# EAGLE design data_proV2.0 - B (EAGLE 8.0.1)
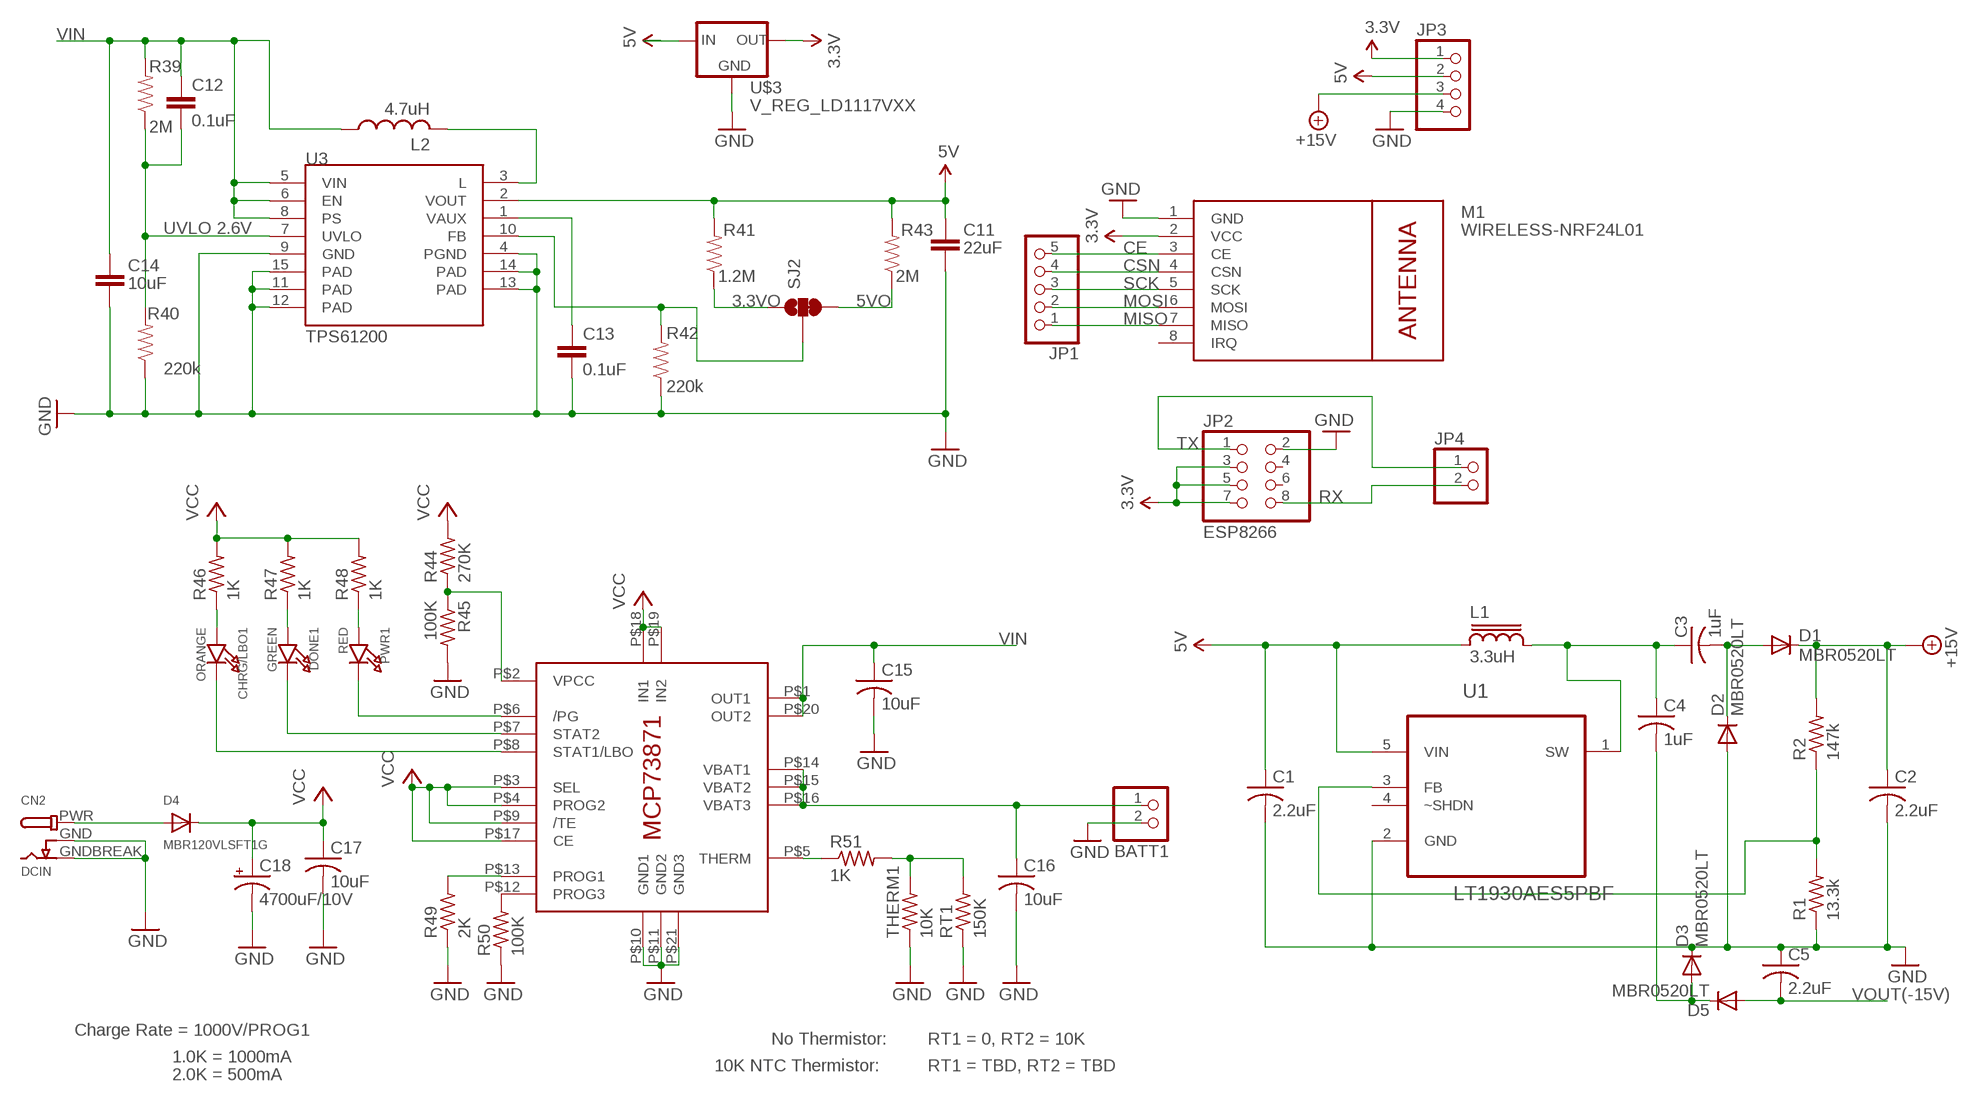
[diagram p0: schematic, sheet 1]

## Parts
BATT1  JST_2PIN-SMT-RA  [JST-PH-2-SMT-RA]
C1  2.2uF  C-USC0805  [C0805]
C2  2.2uF  C-USC1206  [C1206]
C3  1uF  C-USC1206  [C1206]
C4  1uF  C-USC1206  [C1206]
C5  2.2uF  C-USC1206  [C1206]
C11  22uF  CAP0805  [0805]
C12  0.1uF  CAP0603-CAP  [0603-CAP]
C13  0.1uF  CAP0603-CAP  [0603-CAP]
C14  10uF  CAP1206  [1206]
C15  10uF  C-USC0805K  [C0805K]
C16  10uF  C-USC0805K  [C0805K]
C17  10uF  C-USC0805K  [C0805K]
C18  4700uF/10V  CPOL-USE5-13  [E5-13]
CHRG/LBO1  ORANGE  LED0805_NOOUTLINE  [CHIPLED_0805_NOOUTLINE]
CN2  DCIN  DCBARRELSMT  [DCJACK_2MM_SMT]
D1  MBR0520LT  [SOD123]
D2  MBR0520LT  [SOD123]
D3  MBR0520LT  [SOD123]
D4  MBR120VLSFT1G  DIODESOD-123  [SOD-123]
D5  MBR0520LT  [SOD123]
DONE1  GREEN  LED0805_NOOUTLINE  [CHIPLED_0805_NOOUTLINE]
IC8  MCP73871  [QFN20_4MM]
JP1  PINHD-1X5  [1X05]
JP2  ESP8266  PINHD-2X4  [2X04]
JP3  PINHD-1X4  [1X04]
JP4  PINHD-1X2  [1X02]
L1  3.3uH  CR43  [CR43]
L2  4.7uH  L-USL3225M  [L3225M]
M1  WIRELESS-NRF24L01  [WIRELESS-NRF24L01]
PWR1  RED  LED0805_NOOUTLINE  [CHIPLED_0805_NOOUTLINE]
R1  13.3k  R-US_R0805  [R0805]
R2  147k  R-US_R0805  [R0805]
R39  2M  RESISTOR0603-RES  [0603-RES]
R40  220k  RESISTOR0603-RES  [0603-RES]
R41  1.2M  RESISTOR0603-RES  [0603-RES]
R42  220k  RESISTOR0603-RES  [0603-RES]
R43  2M  RESISTOR0603-RES  [0603-RES]
R44  270K  R-US_R0805  [R0805]
R45  100K  R-US_R0805  [R0805]
R46  1K  R-US_R0805  [R0805]
R47  1K  R-US_R0805  [R0805]
R48  1K  R-US_R0805  [R0805]
R49  2K  R-US_FLIPFLOP  [0805-THM]
R50  100K  R-US_R0805  [R0805]
R51  1K  R-US_M0805  [M0805]
RT1  150K  R-US_M0805  [M0805]
SJ2  SOLDERJUMPER_2WAYPASTE2&3  [SJ_3_PASTE2&3]
THERM1  10K  R-US_FLIPFLOP  [0805-THM]
U1  LT1930AES5PBF  [SOT95P280X145-5N]
U3  TPS61200  [QFN-10_PAD]
U$3  V_REG_LD1117VXX  [78XXL]

## Nets
3.3V: JP2.3 JP2.5 JP2.7 JP3.1 M1.2(VCC) U$3.GND(OUT)
3.3VO: R41.1 SJ2.1
5V: C1.1 C11.1 JP3.2 L1.1 R41.2 R43.2 U1.5(VIN) U3.2(VOUT) U$3.OUT(IN)
5VO: R43.1 SJ2.3
+15V: C2.1 D1.C JP3.3 R2.2
BATT2: BATT1.1 C16.1 IC8.P$14(VBAT1) IC8.P$15(VBAT2) IC8.P$16(VBAT3)
CE: JP1.5 M1.3(CE)
CSN: JP1.4 M1.4(CSN)
FB1: R42.2 SJ2.2 U3.10(FB)
GND: BATT1.2 C1.2 C2.2 C5.1 C11.2 C13.2 C14.2 C15.2 C16.2 C17.2 C18.- CN2.GND(GNDBREAK) CN2.GNDBREAK(GND) D2.A D3.C IC8.P$10(GND1) IC8.P$11(GND2) IC8.P$21(GND3) JP2.2 JP3.4 M1.1(GND) R1.1 R40.1 R42.1 R45.2 R49.1 R50.1 RT1.1 THERM1.1 U1.2(GND) U3.4(PGND) U3.9(GND) U3.11(PAD) U3.12(PAD) U3.13(PAD) U3.14(PAD) U3.15(PAD) U$3.IN(GND)
MISO: JP1.1 M1.7(MISO)
MOSI: JP1.2 M1.6(MOSI)
N$1: C4.2 D3.A D5.C
N$2: C3.1 C4.1 L1.2 U1.1(SW)
N$3: R1.2 R2.1 U1.3(FB)
N$4: C3.2 D1.A D2.C
N$37: L2.2 U3.3(L)
N$38: C13.1 U3.1(VAUX)
N$39: IC8.P$2(VPCC) R44.1 R45.1
N$40: IC8.P$6(/PG) PWR1.C
N$41: DONE1.C IC8.P$7(STAT2)
N$42: CHRG/LBO1.C IC8.P$8(STAT1/LBO)
N$43: CHRG/LBO1.A R46.1
N$44: DONE1.A R47.1
N$45: PWR1.A R48.1
N$46: IC8.P$12(PROG3) R50.2
N$47: IC8.P$13(PROG1) R49.2
N$48: IC8.P$5(THERM) R51.1
N$49: R51.2 RT1.2 THERM1.2
N$50: CN2.PWR D4.A
RX: JP2.8 JP4.2
SCK: JP1.3 M1.5(SCK)
TX: JP2.1 JP4.1
UVLO1: C12.2 R39.1 R40.2 U3.7(UVLO)
VCC: C17.1 C18.+ D4.C IC8.P$3(SEL) IC8.P$4(PROG2) IC8.P$9(/TE) IC8.P$17(CE) IC8.P$18(IN1) IC8.P$19(IN2) R44.2 R46.2 R47.2 R48.2
VIN: C12.1 C14.1 C15.1 IC8.P$1(OUT1) IC8.P$20(OUT2) L2.1 R39.2 U3.5(VIN) U3.6(EN) U3.8(PS)
VOUT(-15V): C5.2 D5.A
Unconnected: JP2.4 JP2.6 M1.8(IRQ) U1.4(~SHDN)

## Notes on the sheet
- UVLO 2.6V
- Charge Rate = 1000V/PROG1
- No Thermistor: | RT1 = 0, RT2 = 10K
- 1.0K = 1000mA
- 10K NTC Thermistor: | RT1 = TBD, RT2 = TBD
- 2.0K = 500mA

## Library data of the parts
BATT1 = adafruit:JST_2PIN: JST 2-Pin Connectors of various flavors SMT-RA (S2B-PH-SM4) 4UConnector #17311 SMT (B2B-PH-SM4) THM-RA (S2B-PH) THM (B2B-PH)
C1 C15-C17 = adafruit:C-US: CAPACITOR, American symbol
C2-C5 = rcl:C-US: CAPACITOR, American symbol
C11 C14 = CH_passive:CAP: Capacitor Standard 0603 ceramic capacitor, and 0.1" leaded capacitor.
C12 C13 = SparkFun:CAP: Capacitor Standard 0603 ceramic capacitor, and 0.1" leaded capacitor.
C18 = adafruit:CPOL-US: POLARIZED CAPACITOR, American symbol
CHRG/LBO1 DONE1 PWR1 = microbuilder:LED: LED 0603 - 0603 Surface Mount Package 2mA: Green LED - Low Power (3.9mcd, 2ma, 1.7Vf) - Digikey: 475-2709-2-ND Orange LED - Low Power (9.8mcd, 2ma, 1.8Vf) - Digikey: 475-1194-2-ND Red LED - Low Power (5mcd, 2ma, 1.8Vf) - Digikey: 475-1195-2-ND Yellow LED - Low Power (7mcd, 2ma, 1.8Vf) - Digikey: 475-1196-2-ND 5mA: Blue LED - Low Power (17mcd, 5ma, 2.9Vf) - Digikey: LNJ937W8CRACT-ND 0805 - 0805 Surface Mount Package 2mA: Red LED (8.8mcd, 2mA, 1.8Vf, Clear) - Low Power [Digikey: 475-2510-1-ND] Green LED (5mcd, 2mA, 1.8Vf, Clear) - Low Power [Digikey: 475-2730-1-ND] Yellow LED (11.3mcd, 2mA, 1.8Vf, Clear) - Low Power [Digikey: 475-2555-1-ND] 20mA: Red LED (104mcd, 20mA, Diffused) - LS R976 [Digikey: 475-1278-6-ND] Red LED (12mcd, 20mA, 2.0Vf, Clear) - APT2012EC [Digikey: 754-1128-1-ND] Green LED (15mcd, 20mA, 2.2Vf, Clear) - APT2012GC [Digikey: 754-1131-1-ND] Orange LED (160mcd, 20mA, 2.1Vf, Clear) - APT2012SECK [Digikey: 754-1130-1-ND] 1206 - 1206 Surface Mount Package Green LED (26mcd, 20mA, Diffused) - LG N971 [Digikey: 475-1407-6-ND] Red LED (15mcd, 20mA, Diffused) - LH N974 [Digikey: 475-1416-6-ND] Cree - Cree High-Power Surface Mount LEDs XPEBWT-L1-0000-00D50 - White 111lm 350mA 2.9Vf 6200K 110° XTEAWT-00-0000-00000LEE3 - White 114lm 350mA 2.85Vf 5000K 115° Everlight - Everlight 45-21 Series Surface Mount LEDs 45-21/QK2C-B2832AC2CB2/2T - Warm White 2000mcd 20mA 3.25Vf 3050K 120° 45-21/LK2C-B38452C4CB2/2T - Nuetral White 2000mcd 20mA 3.25Vf 4150K 120° 45-21/LK2C-B50634C6CB2/2T - Cold White 2200mcd 20mA 3.25Vf 5650K 120° PLCC2 Reverse Mount LS T77K-J1L2-1-0-2-R18-Z - Red 11.25mcd 2mA 1.8Vf 630nm 120° LO T77K-L1M2-24-Z - Orange 19.6mcd 2mA 1.8Vf 606nm 120° LY T77K-K2M1-26-Z - Yellow 15.7mcd 2mA 1.8Vf 587nm 120°
CN2 = microbuilder:DCBARREL: DC Barrel Jack DCJACK_1.3MM_PTH - Through Hole 1.3mm Jack (4UConnector: 05536) DCJACK_2MM_PTH - Through Hole 2.0/2.1 Jack (4UConnector: 05537) DCJACK_2MM_SMT - SMT 2.0/2.1mm Jack(4UConnector: 03267)
D1-D3 D5 = diode:MBR0520LT: SCHOTTKY BARRIER RECTIFIER Source: http://onsemi.com .. MBR0520LT1-D.pdf
D4 = microbuilder:DIODE: Diode SMA Model Volts Amps Type Vf Vr Digikey # Notes SSA34-E3 40V 3A Schottky 480mV @ 3A 200uA @ 40V SSA34-E3/61TGITR-ND CDBA120-G 20V 1A Schottky 500mV @ 1A 500uA @ 20V 641-1014-6-ND REEL MBRA210 10V 2A Schottky 350mV @ 2A 700uA @ 10V MBRA210LT3 SOD-123 Model Volts Amps Type Vf Vr Order # Notes BAT54T1G 30V 200mA Schottky 800mV @ 200mA 2uA @ 25V BAT54T1GOSTR-ND B0530W 30V 500mA Schottky 430mV @ 500mA 130uA @ 30V B0530W-FDICT-ND REEL MBR120 20V 1A Schottky 340mV @ 1A MBR120VLSFT1GOSCT-ND SOD-323 Model Volts Amps Type Vf Vr Order # Notes PMEG2005EJ 20V 500mA Schottky 355mV @ 500mA 568-4110-1-ND ZLLS410 10V 570mA Schottky 380mV @ 570mA ZLLS410CT-ND 1N4148WS 75V 150mA Silicon/Simple 1V 1N4148WSFSCT-ND REEL SOD-523 Model Volts Amps Type Vf Vr Order # Notes BAT54XV2 30V 200mA Schottky 0.8V @ 100mA BAT54XV2CT-ND TB751S 30V 30mA Schottky RB751S-40TE61CT-ND SOT23-R/W (R = Solder Paste/Reflow Ovens, W = Hand-Soldering) Model Volts Amps Type Vf Vr Order # Notes BAT54FILM 40V 300mA Schottky 497-7162-1-ND
IC8 = adafruit:MCP73871
JP1 = pinhead:PINHD-1X5: PIN HEADER
JP2 = adafruit:PINHD-2X4: PIN HEADER
JP3 = pinhead:PINHD-1X4: PIN HEADER
JP4 = pinhead:PINHD-1X2: PIN HEADER
L1 = inductor-sumida:CR43: Power Inductor
L2 = resistor:L-US: INDUCTOR, American symbol
M1 = diy-modules:WIRELESS-NRF24L01: 2.4 GHz Wireless Module based on NRF24L01 chip More details available here: http://www.electrodragon.com/w/NRF24L01 Click here to find device on ebay.com <http://www.ebay.com/sch/nrf24l01+arduino>
R1 R2 = rcl:R-US_: RESISTOR, American symbol
R39-R43 = SparkFun:RESISTOR: Resistor Basic schematic elements and footprints for 0603, 1206, and PTH resistors.
R44-R51 RT1 THERM1 = adafruit:R-US_: RESISTOR, American symbol
SJ2 = SparkFun:SOLDERJUMPER_2WAY: Solder Jumper 2 way solder jumper
U1 = LTC_By_element14_Batch_1:LT1930AES5PBF: DC/DC Converter; MPN: LT1930AES5#PBF; OC_FARNELL: 1531503; OC_NEWARK: 61M3368; PACKAGE: SOT-23-5; SUPPLIER: Linear Technology
U3 = SparkFun:TPS61200: DC to DC Booster
U$3 = SparkFun-PowerIC:V_REG_LD1117VXX: LD1117VXX voltage regulator. We carry the 3.3V version (COM-00526) in TO-220 package.

## Board
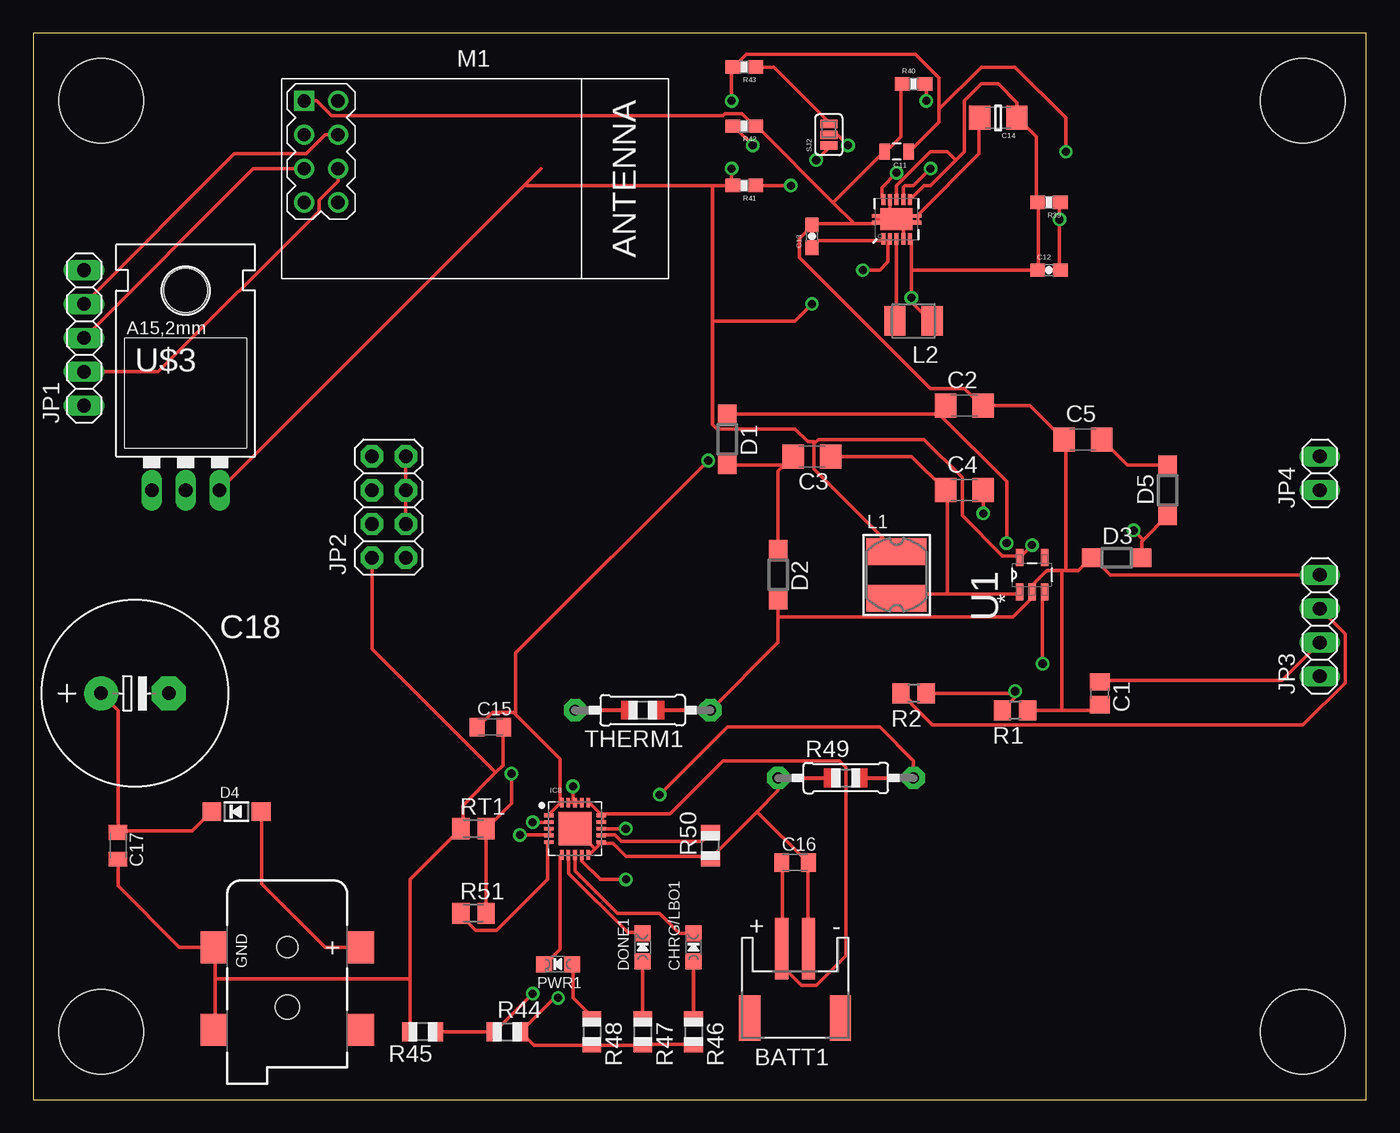
[diagram p1: board, top side]
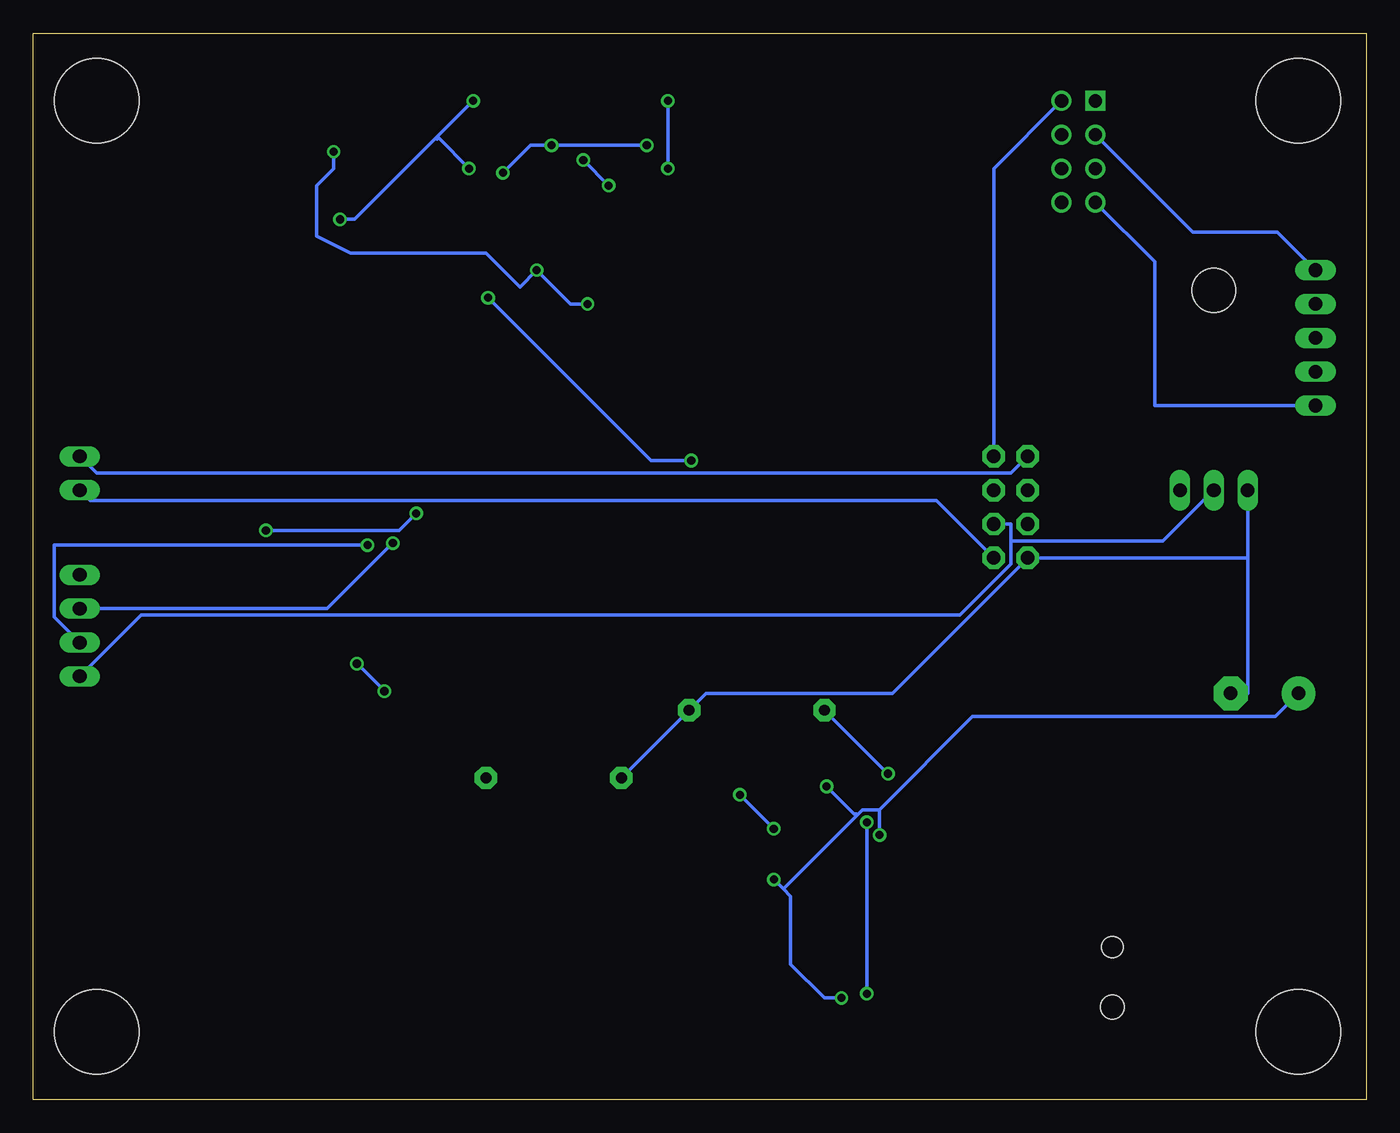
[diagram p2: board, bottom side, seen from below]

Size 100 x 80 mm. Coordinates in mm from the lower left corner, seen from the top.
Outline: 0,0 100,0 100,80 0,80 0,0
Copper layers (1*16): Top 0.035mm / dielectric 1.5mm / Bottom 0.035mm
Design rules "data_proV2.0 - B": minimum track width 10mil, minimum drill 24mil, track to track 8mil, track to pad 8mil, pad to pad 8mil, via to via 8mil, smd to smd 8mil, copper to edge 40mil, drill to drill 8mil, minimum pad ring 10mil, minimum via ring 8mil, stop-mask expansion 4mil, vias tented up to drill 0mil, thermal gap 10mil
Holes 6.35 mm at 5.08,5.08 95.25,5.08 95.25,74.93 5.08,74.93

### Footprints (pad centres in the part's own frame; a part is rotated, then mirrored left to right if it is on the bottom)
JST-PH-2-SMT-RA = smd 1 x 4.6: 1 1,-3.7; 2 -1,-3.7 | smd 1.6 x 3.4: NC1 -3.4,1.5; NC2 3.4,1.5
C0805 = smd 1.3 x 1.5: 1 -0.85,0; 2 0.85,0
C1206 = smd 1.6 x 1.8: 1 -1.4,0; 2 1.4,0
0805 = smd 0.8 x 1.2: 1 -0.9,0; 2 0.9,0
0603-CAP = smd 1.1 x 1: 1 -0.85,0; 2 0.85,0
1206 = smd 1.6 x 1.8: 1 -1.4,0; 2 1.4,0
C0805K = smd 1.1 x 1.4: 1 -1,0; 2 1,0
E5-13 = drill 1.016 pad 2.54: + -2.54,0 | drill 1.016 pad 2.54 octagon: - 2.54,0
CHIPLED_0805_NOOUTLINE = smd 1.2 x 1.2: A 0,-1.05; C 0,1.05
DCJACK_2MM_SMT = smd 2.4 x 2: GND 0,-5.5; GNDBREAK 6.2,-5.5; PWR 0,5.5; PWR2 6.2,5.5 | hole 1.6: 0,0 | hole 1.8: 4.5,0
SOD123 = smd 1.4 x 1.4: A 1.9,0; C -1.9,0
SOD-123 = smd 1.4 x 1.4: A 1.85,0; C -1.85,0
QFN20_4MM = smd 0.73 x 0.28: P$1 -1.965,1; P$2 -1.965,0.5; P$3 -1.965,0; P$4 -1.965,-0.5; P$5 -1.965,-1; P$11 1.965,-1; P$12 1.965,-0.5; P$13 1.965,0; P$14 1.965,0.5; P$15 1.965,1 | smd 0.28 x 0.73: P$6 -1,-1.965; P$7 -0.5,-1.965; P$8 0,-1.965; P$9 0.5,-1.965; P$10 1,-1.965; P$16 1,1.965; P$17 0.5,1.965; P$18 0,1.965; P$19 -0.5,1.965; P$20 -1,1.965 | smd 2.5 x 2.5: P$21 0,0
1X05 = drill 1.016 long: 1 -5.08,0; 2 -2.54,0; 3 0,0; 4 2.54,0; 5 5.08,0
2X04 = drill 1.016 pad 1.676 octagon: 1 -3.81,-1.27; 2 -3.81,1.27; 3 -1.27,-1.27; 4 -1.27,1.27; 5 1.27,-1.27; 6 1.27,1.27; 7 3.81,-1.27; 8 3.81,1.27
1X04 = drill 1.016 long: 1 -3.81,0; 2 -1.27,0; 3 1.27,0; 4 3.81,0
1X02 = drill 1.016 long: 1 -1.27,0; 2 1.27,0
CR43 = smd 4.5 x 2: 1 0,1.75; 2 0,-1.75
L3225M = smd 1.6 x 2.2: 1 -1.4,0; 2 1.4,0
WIRELESS-NRF24L01 = drill 1 square: 1 -12.7,6.35 | drill 1: 2 -10.16,6.35; 3 -12.7,3.81; 4 -10.16,3.81; 5 -12.7,1.27; 6 -10.16,1.27; 7 -12.7,-1.27; 8 -10.16,-1.27
R0805 = smd 1.3 x 1.5: 1 -0.95,0; 2 0.95,0
0603-RES = smd 1.1 x 1: 1 -0.85,0; 2 0.85,0
R0805' = smd 1.1 x 1.4: 1 -1,0; 2 1,0
0805-THM = drill 0.813 pad 1.676 octagon: 1 -5.08,0; 2 5.08,0
M0805 = smd 1.3 x 1.6: 1 -0.95,0; 2 0.95,0
SJ_3_PASTE2&3 = smd 0.635 x 1.27: 1 -0.813,0; 2 0,0; 3 0.813,0
SOT95P280X145-5N = smd 1.27 x 0.559: 1 -1.295,0.94; 2 -1.295,0; 3 -1.295,-0.94; 4 1.295,-0.94; 5 1.295,0.94
QFN-10_PAD = smd 0.297 x 0.85: 1 -1,-1.475; 2 -0.5,-1.475; 3 0,-1.475; 4 0.5,-1.475; 5 1,-1.475; 6 1,1.475; 7 0.5,1.475; 8 0,1.475; 9 -0.5,1.475; 10 -1,1.475 | smd 0.7 x 0.28: 11 -1.5,0.25; 12 -1.5,-0.25; 13 1.5,0.25; 14 1.5,-0.25 | smd 2.4 x 1.65: 15 0,0
78XXL = drill 1.016 long: GND 0,-3.81; IN -2.54,-3.81; OUT 2.54,-3.81 | hole 3.302: 0,11.176

### Placement (x,y rotation side)
BATT1  57.15,7.62 180 top
C1  80.01,30.48 270 top
C2  69.85,52.07 0 top
C3  58.42,48.26 180 top
C4  69.85,45.72 0 top
C5  78.74,49.53 0 top
C11  64.77,71.12 180 top
C12  76.2,62.23 0 top
C13  58.42,64.77 90 top
C14  72.39,73.66 180 top
C15  34.29,27.94 0 top
C16  57.15,17.78 0 top
C17  6.35,19.05 270 top
C18  7.62,30.48 0 top
CHRG/LBO1  49.53,11.43 0 top
CN2  19.05,11.43 270 top
D1  52.07,49.53 270 top
D2  55.88,39.37 270 top
D3  81.28,40.64 0 top
D4  15.24,21.59 0 top
D5  85.09,45.72 90 top
DONE1  45.72,11.43 0 top
IC8  40.64,20.32 0 top
JP1  3.81,57.15 90 top
JP2  26.67,44.45 90 top
JP3  96.52,35.56 90 top
JP4  96.52,46.99 90 top
L1  64.77,39.37 0 top
L2  66.04,58.42 180 top
M1  33.02,68.58 0 top
PWR1  39.37,10.16 90 top
R1  73.66,29.21 180 top
R2  66.04,30.48 180 top
R39  76.2,67.31 180 top
R40  66.04,76.2 0 top
R41  53.34,68.58 180 top
R42  53.34,73.03 180 top
R43  53.34,77.47 180 top
R44  270K  [R0805']  35.56,5.08 0 top
R45  100K  [R0805']  29.21,5.08 180 top
R46  1K  [R0805']  49.53,5.08 270 top
R47  1K  [R0805']  45.72,5.08 270 top
R48  1K  [R0805']  41.91,5.08 270 top
R49  60.96,24.13 0 top
R50  100K  [R0805']  50.8,19.05 90 top
R51  33.02,13.97 0 top
RT1  33.02,20.32 0 top
SJ2  59.69,72.39 90 top
THERM1  45.72,29.21 180 top
U1  74.93,39.37 90 top
U3  64.77,66.04 0 top
U$3  11.43,49.53 0 top

### Tracks (layer width: path | path; a pad name or v marks a point on that pad's centre or on a via)
3.3V
  Top 0.254: JP2.7 JP2.5 JP2.3
  Bottom 0.254: M1.2 27.94,69.85 JP2.7 | JP3.1 91.92,36.35 30.48,36.35 26.67,40.16 26.67,41.91 | 26.67,41.91 26.67,43.18 JP2.3 | U$3.GND 15.24,41.91 26.67,41.91
3.3VO  (via drill 0.61)
  Top 0.254: v56.83,68.58 R41.1 | v58.74,70.48 59.69,71.44 SJ2.1
  Bottom 0.254: v58.74,70.48 v56.83,68.58
5V  (via drill 0.6, 0.61)
  Top 0.254: JP3.2 93.66,31.43 80.01,31.43 C1.1 | 58.66,49.29 58.58,49.21 58.58,47.31 L1.1 | 58.66,49.29 58.9,49.53 66.83,49.53 69.69,46.67 69.69,43.81 72.71,40.8 73.98,40.8 U1.5 74.14,40.8 v74.93,41.59 | U$3.OUT 36.91,68.66 | 36.91,68.66 38.1,69.85 | 58.66,49.29 58.58,49.37 58.1,49.37 57.15,50.32 51.28,50.32 50.96,50.64 50.96,58.42 | C11.1 65.72,71.12 67.94,73.34 67.94,76.68 66.2,78.42 53.5,78.42 52.55,77.47 R43.2 52.39,77.47 v52.39,74.93 | 50.96,68.58 36.99,68.58 36.91,68.66 | 50.96,68.58 52.39,68.58 | 50.96,58.42 50.96,68.58 | 52.39,68.58 v52.39,69.85 | 52.39,68.58 R41.2 | 50.96,58.42 57.15,58.42 v58.42,59.69 | v62.23,62.23 63.5,62.23 64.14,62.87 64.14,64.43 U3.2 | 67.94,73.66 67.94,74.3 71.12,77.47 73.66,77.47 77.47,73.66 v77.47,71.12
  Bottom 0.254: JP3.2 98.42,36.2 98.42,41.59 v74.93,41.59 | v52.39,69.85 v52.39,74.93 | v58.42,59.69 59.69,59.69 v62.23,62.23 63.5,60.96 66.04,63.5 76.2,63.5 78.74,64.77 78.74,68.58 77.47,69.85 v77.47,71.12
5VO
  Top 0.254: R43.1 55.56,77.47 59.69,73.34 SJ2.3
+15V  (via drill 0.61)
  Top 0.254: D1.C 67.79,51.44 68.42,52.07 C2.1 67.94,51.44 73.03,46.35 v73.03,41.75 | JP3.3 98.42,34.92 98.42,31.27 95.25,28.1 67.47,28.1 65.88,29.69 65.88,29.84 65.25,30.48 R2.2
  Bottom 0.254: v73.03,41.75 77.95,36.83 JP3.3
BATT2
  Top 0.254: IC8.P$14 42.7,20.95 42.7,21.27 IC8.P$15 | IC8.P$16 41.75,22.23 42.55,21.43 IC8.P$15 | C16.1 56.2,17.78 56.2,11.43 BATT1.1 56.2,11.27 56.2,10 57.63,8.57 58.74,8.57 60.96,10.79 60.96,24.92 60.48,25.4 51.75,25.4 47.78,21.43 42.7,21.43 IC8.P$15
CE
  Bottom 0.254: M1.3 13.02,65.09 6.67,65.09 JP1.5
CSN
  Top 0.254: M1.4 21.91,72.39 20.48,70.96 15.08,70.96 JP1.4
FB1  (via drill 0.61)
  Top 0.254: v64.77,69.53 63.66,68.42 63.66,67.63 U3.10 | v61.12,71.6 60.33,72.39 SJ2.2 | v53.98,71.6 52.55,73.03 R42.2
  Bottom 0.254: v64.77,69.53 62.71,71.6 v61.12,71.6 v53.98,71.6
GND
  Top 0.254: C17.2 6.35,16.03 10.95,11.43 CN2.GND 13.65,11.43 13.65,9.05 | 13.65,9.05 13.65,5.24 CN2.GNDBREAK | 28.26,9.05 28.26,16.51 RT1.1 32.23,20.32 32.23,22.07 34.69,24.53 | 28.26,9.05 28.26,5.08 R45.2 | 34.69,24.53 35.24,25.08 35.24,27.94 C15.2 | 28.26,9.05 13.65,9.05 | JP2.2 25.4,33.81 34.69,24.53 | M1.1 21.27,74.93 22.38,73.82 51.75,73.82 51.91,73.98 53.18,73.98 54.13,73.03 R42.1 54.29,73.03 60.01,67.31 | 42.15,18.81 42.55,19.21 IC8.P$11 42.7,19.21 43.5,19.21 44.45,18.26 50.8,18.26 R50.1 50.8,18.1 54.29,21.59 | 42.15,18.81 41.75,18.41 IC8.P$10 | IC8.P$21 42.15,18.81 | 55.88,36.2 55.88,34.29 THERM1.1 | 55.88,36.2 D2.A | 77.15,29.21 79.69,29.21 80.01,29.53 C1.2 | 77.15,29.21 R1.1 | 77.47,39.69 78.42,39.69 D3.C 79.53,40.64 80.8,39.37 JP3.4 | 77.47,39.69 77.15,39.69 | 77.15,39.69 76.04,39.69 74.93,38.58 U1.2 74.93,37.62 73.5,36.2 55.88,36.2 | 77.15,39.69 77.15,29.21 | 77.47,39.69 77.47,49.53 C5.1 77.31,49.53 74.77,52.07 C2.2 71.12,52.07 69.85,53.34 67.31,53.34 57.47,63.18 57.47,64.61 58.42,65.56 C13.2 58.42,65.72 61.59,65.72 | R40.1 65.09,76.2 65.09,72.23 63.98,71.12 C11.2 63.82,71.12 60.01,67.31 | 63.34,66.04 63.34,66.2 U3.11 | 63.34,66.04 63.34,65.88 | U3.15 63.34,66.04 | 63.34,65.88 66.2,65.88 U3.14 66.36,65.88 66.36,66.2 U3.13 66.36,66.36 70.96,70.96 70.96,73.66 C14.2 | 63.34,65.88 U3.12 63.18,65.72 61.59,65.72 | 61.59,65.72 60.01,67.31 | U3.4 65.27,65.54 U3.15 | U3.9 64.27,66.54 U3.15 | 58.1,17.78 58.1,11.43 BATT1.2 | 54.29,21.59 55.88,23.18 R49.1 | 54.29,21.59 58.1,17.78 | 58.1,17.78 C16.2
  Bottom 0.254: 8.89,40.64 8.89,30.48 C18.- | 8.89,40.64 U$3.IN | 8.89,40.64 JP2.2 35.56,30.48 49.53,30.48 THERM1.1 R49.1
MISO
  Bottom 0.254: M1.7 15.88,62.87 15.88,52.07 JP1.1
MOSI
  Top 0.254: M1.6 22.86,68.9 21.43,67.47 21.43,66.67 9.37,54.61 JP1.2
N$1  (via drill 0.61)
  Top 0.254: 83.26,41.99 D5.C | 83.26,41.99 83.19,41.91 D3.A | v71.28,43.97 71.28,45.72 C4.2 | 83.26,41.99 v82.55,42.7
  Bottom 0.254: v71.28,43.97 72.55,42.7 v82.55,42.7
N$2
  Top 0.254: 68.58,37.94 65.09,37.94 L1.2 | 68.58,37.94 73.98,37.94 U1.1 | 68.58,37.94 68.58,45.72 C4.1 68.42,45.72 65.88,48.26 C3.1
N$3  (via drill 0.61)
  Top 0.254: v75.72,32.7 75.72,37.94 U1.3 | 73.66,30.48 73.66,30.16 R1.2 | 73.66,30.48 R2.1 | 73.66,30.48 v73.66,30.64
  Bottom 0.254: v73.66,30.64 v75.72,32.7
N$4
  Top 0.254: D2.C 55.88,47.15 56.28,47.55 | 56.28,47.55 56.99,48.26 C3.2 | D1.A 56.2,47.62 56.28,47.55
N$37
  Top 0.254: U3.3 64.77,58.42 L2.2
N$38
  Top 0.254: U3.1 63.66,64.45 58.9,64.45 58.42,63.98 C13.1
N$39  (via drill 0.61)
  Top 0.254: v37.47,20.8 38.58,20.8 IC8.P$2 | v37.47,7.94 34.61,5.08 R44.1 R45.1
  Bottom 0.254: v37.47,7.94 v37.47,20.8
N$40
  Top 0.254: IC8.P$6 39.53,18.26 39.53,11.27 38.42,10.16 PWR1.C
N$41
  Top 0.254: IC8.P$7 40.16,18.26 40.16,16.99 44.61,12.54 45.72,12.54 DONE1.C
N$42
  Top 0.254: CHRG/LBO1.C 48.48,12.48 46.99,13.97 43.81,13.97 40.64,17.14 IC8.P$8
N$43
  Top 0.254: R46.1 CHRG/LBO1.A
N$44
  Top 0.254: R47.1 DONE1.A
N$45
  Top 0.254: PWR1.A 40.48,10.16 40.48,7.62 41.91,6.19 R48.1
N$46
  Top 0.254: IC8.P$12 42.7,19.84 43.66,19.84 44.13,19.37 50.16,19.37 50.8,20 R50.2
N$47  (via drill 0.6, 0.61)
  Top 0.254: R49.2 66.04,25.4 63.5,27.94 52.07,27.94 v46.99,22.86 | v44.45,20.32 IC8.P$13
  Bottom 0.254: v46.99,22.86 v44.45,20.32
N$48
  Top 0.254: IC8.P$5 38.58,19.21 38.58,16.51 34.77,12.7 33.18,12.7 32.23,13.65 32.23,13.97 R51.1
N$49  (via drill 0.61)
  Top 0.254: RT1.2 R51.2 | v35.88,24.45 35.88,22.23 RT1.2 | RT1.2
  Bottom 0.254: v35.88,24.45 THERM1.2
N$50
  Top 0.254: D4.A 17.14,21.59 17.14,16.19 21.91,11.43 CN2.PWR
RX
  Bottom 0.254: JP4.2 95.25,46.99 26.67,46.99 JP2.8
SCK
  Top 0.254: M1.5 16.51,69.85 JP1.3
TX
  Bottom 0.254: JP4.1 95.73,44.93 32.23,44.93 JP2.1
UVLO1  (via drill 0.6, 0.61)
  Top 0.254: C12.2 76.99,62.23 v76.99,66.04 76.99,67.31 R39.1 | v66.99,74.93 66.99,76.2 R40.2 | v67.31,69.85 66.04,68.58 65.41,68.58 65.27,68.44 U3.7
  Bottom 0.254: 69.77,72.15 75.88,66.04 v76.99,66.04 | 69.77,72.15 v66.99,74.93 | 69.69,72.23 69.61,72.15 | 69.61,72.15 v67.31,69.85 | 69.61,72.15 69.69,72.07 69.77,72.15
VCC  (via drill 0.6, 0.61)
  Top 0.254: 6.35,20.16 11.91,20.16 13.34,21.59 D4.C | 6.35,20.16 6.35,29.21 C18.+ | 6.35,20.16 C17.1 | IC8.P$3 38.73,20.32 38.73,19.84 IC8.P$4 38.58,19.84 v36.51,19.84 | R46.2 49.53,4.13 45.88,4.13 R47.2 R48.2 37.56,4.08 R44.2 39.1,7.62 v39.37,7.62 | v44.45,16.51 42.55,16.51 41.14,17.91 IC8.P$9 | IC8.P$17 IC8.P$18 40.48,22.29 | 40.48,22.29 IC8.P$19 | v40.48,23.5 40.48,22.29
  Bottom 0.254: v39.37,7.62 40.64,7.62 43.18,10.16 43.18,15.24 43.74,15.8 | 43.74,15.8 v44.45,16.51 | 36.51,21.75 v36.51,19.84 | 36.51,21.75 37.78,21.75 38.18,21.35 | 43.74,15.8 38.18,21.35 | v40.48,23.5 38.42,21.43 38.26,21.43 38.18,21.35 | 36.51,21.75 29.53,28.73 6.83,28.73 C18.+
VIN  (via drill 0.61)
  Top 0.254: IC8.P$1 38.73,21.43 39.53,22.23 IC8.P$20 39.53,22.38 39.53,25.56 36.12,28.97 | 36.12,28.97 36.04,29.05 34.45,29.05 33.34,27.94 C15.1 | v50.64,47.94 36.2,33.5 36.2,29.05 36.12,28.97 | 65.88,62.23 v65.88,60.17 65.88,59.85 67.31,58.42 L2.1 | 65.88,62.23 65.88,64.45 U3.5 | 65.88,62.23 C12.1 75.41,62.23 75.41,67.31 R39.2 75.25,67.31 75.25,72.23 73.82,73.66 C14.1 73.79,74.8 72.39,76.2 71.12,76.2 69.85,74.93 69.85,71.12 69.22,70.48 | 69.22,70.48 67.31,68.58 66.83,68.58 U3.6 | U3.8 64.77,68.58 67.31,71.12 68.58,71.12 69.22,70.48
  Bottom 0.254: v65.88,60.17 53.66,47.94 v50.64,47.94
VOUT(-15V)
  Top 0.254: D5.A 82.07,47.62 80.17,49.53 C5.2